# EAGLE schematic cookie (EAGLE 6.5.0)
H-BRIDGE
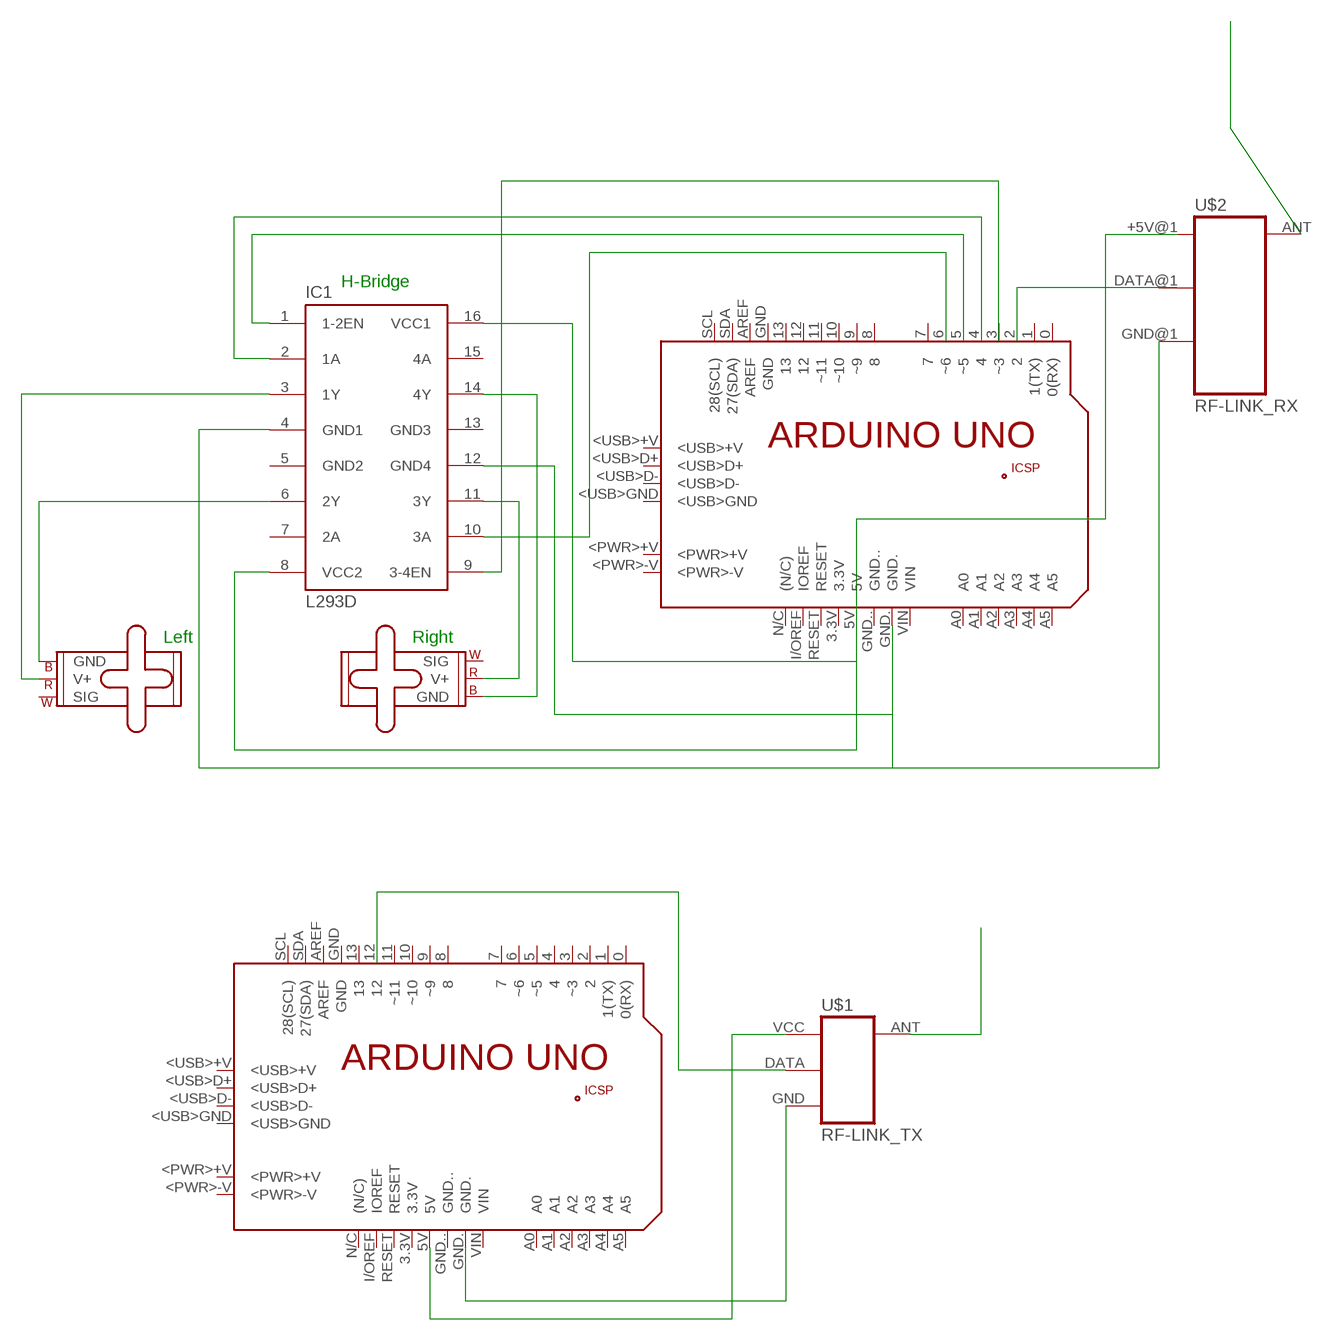
[diagram p0: schematic, sheet 1]

## Parts
IC1  L293D  [DIL16]
M1  SMALL_SERVO  [1X03]
M2  SMALL_SERVO  [1X03]
PCB1  ARDUINO_UNO  [ARDUINO_UNO]
PCB2  ARDUINO_UNO  [ARDUINO_UNO]
U$1  RF-LINK_TX  [RF-LINK_TX]
U$2  RF-LINK_RX  [RF-LINK_RX]

## Nets
N$2: IC1.8(VCC2) IC1.16(VCC1)
N$3: IC1.4(GND1) IC1.12(GND4) PCB1.GND. U$2.GND@1(GND)
N$4: IC1.11(3Y) M2.2(V+)
N$5: U$1.ANT
N$6: IC1.10(3A)
N$7: IC1.9(3-4EN)
N$8: IC1.1(1-2EN)
N$9: IC1.2(1A)
N$10: IC1.3(1Y) M1.2(V+)
N$11: IC1.14(4Y) M2.3(GND)
N$12: IC1.6(2Y) M1.3(GND)
N$13: U$2.ANT
N$14: PCB2.5V U$1.VCC(+5V)
N$15: U$1.DATA
N$16: PCB2.GND. U$1.GND
Unconnected: IC1.7(2A) IC1.15(4A) M1.1(SIG) M2.1(SIG) PCB1.0(0(RX)) PCB1.1(1(TX)) PCB1.2 PCB1.3(~3) PCB1.3.3V PCB1.4 PCB1.5(~5) PCB1.5V PCB1.6(~6) PCB1.7 PCB1.8 PCB1.9(~9) PCB1.10(~10) PCB1.11(~11) PCB1.12 PCB1.13 PCB1.+5V PCB1.<PWR>+V PCB1.<PWR>-V PCB1.<USB>+V PCB1.<USB>D+ PCB1.<USB>D- PCB1.<USB>GND PCB1.A0 PCB1.A1 PCB1.A2 PCB1.A3 PCB1.A4 PCB1.A5 PCB1.AREF PCB1.GND PCB1.GND.. PCB1.GND_ PCB1.I/OREF(IOREF) PCB1.MISO PCB1.MOSI PCB1.N/C((N/C)) PCB1.RESET PCB1.RESET. PCB1.SCK PCB1.SCL(28(SCL)) PCB1.SDA(27(SDA)) PCB1.VIN PCB2.0(0(RX)) PCB2.1(1(TX)) PCB2.2 PCB2.3(~3) PCB2.3.3V PCB2.4 PCB2.5(~5) PCB2.6(~6) PCB2.7 PCB2.8 PCB2.9(~9) PCB2.10(~10) PCB2.11(~11) PCB2.12 PCB2.13 PCB2.+5V PCB2.<PWR>+V PCB2.<PWR>-V PCB2.<USB>+V PCB2.<USB>D+ PCB2.<USB>D- PCB2.<USB>GND PCB2.A0 PCB2.A1 PCB2.A2 PCB2.A3 PCB2.A4 PCB2.A5 PCB2.AREF PCB2.GND PCB2.GND.. PCB2.GND_ PCB2.I/OREF(IOREF) PCB2.MISO PCB2.MOSI PCB2.N/C((N/C)) PCB2.RESET PCB2.RESET. PCB2.SCK PCB2.SCL(28(SCL)) PCB2.SDA(27(SDA)) PCB2.VIN U$2.DATA@1(DATA)

## Notes on the sheet
- H-Bridge
- Left | Right

## Power pins joined to a net without a drawn wire
+5V: U$2.+5V@1(+5V)
GND2: IC1.5(GND2)
GND3: IC1.13(GND3)

## Library data of the parts
IC1 = st-microelectronics:L293D: PUSH-PULL 4 CHANNEL DRIVER; MPN: L293D; OC_FARNELL: 9589619; OC_NEWARK: 56P8249
M1 M2 = SparkFun-Electromechanical:SMALL_SERVO: Small servo motor This is the small servo used in the SIK. SKU: ROB-09065
PCB1 PCB2 = E14_Arduino_published:ARDUINO_UNO: Device for representing an Arduino Uno board with a footprint in an EAGLE design. Created by Dave Young for Element14. More EAGLE documentation at: http://www.element14.com/community/community/knode/cadsoft_eagle
U$1 = SparkFun-RF:RF-LINK_TX: RF Link transmitters WRL-8945, 8946
U$2 = SparkFun-RF:RF-LINK_RX: RF Link receivers- WRL-8947, 8948, 8949, 8950, 10532, 10533